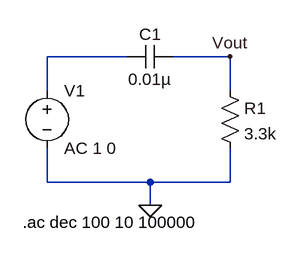
[diagram p0: schematic hpFO.asc]
hpFO.asc, the LTspice schematic file:
Version 4
SHEET 1 880 680
WIRE 224 80 112 80
WIRE 368 80 288 80
WIRE 112 128 112 80
WIRE 368 128 368 80
WIRE 112 256 112 208
WIRE 256 256 112 256
WIRE 368 256 368 208
WIRE 368 256 256 256
WIRE 256 288 256 256
FLAG 256 288 0
FLAG 368 80 Vout
SYMBOL voltage 112 112 R0
WINDOW 123 0 0 Left 0
WINDOW 39 0 0 Left 0
SYMATTR InstName V1
SYMATTR Value AC 1 0
SYMBOL res 352 112 R0
SYMATTR InstName R1
SYMATTR Value 3.3k
SYMBOL cap 224 96 R270
WINDOW 0 32 32 VTop 2
WINDOW 3 0 32 VBottom 2
SYMATTR InstName C1
SYMATTR Value 0.01µ
TEXT 78 312 Left 2 !.ac dec 100 10 100000

The netlist it stands for:
* hpFO.asc
V1 N001 0 AC 1 0
R1 Vout 0 3.3k
C1 N001 Vout 0.01µ
.ac dec 100 10 100000
.backanno
.end

* Results of the author's LTspice run, read from the files saved beside the schematic
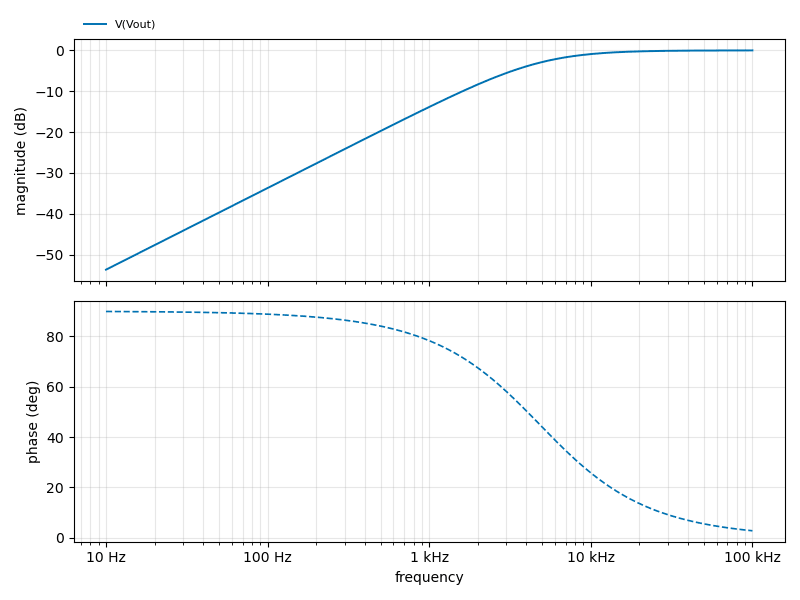
[diagram p1: AC Analysis of hpFO.asc, plotted from the saved traces]
* AC Analysis, 1 run:
*   V(Vout): -53.67 dB at 10 Hz, -0.01 dB at 100 kHz, peak -0.01 dB at 100 kHz, 3 dB below the peak at 4.812 kHz